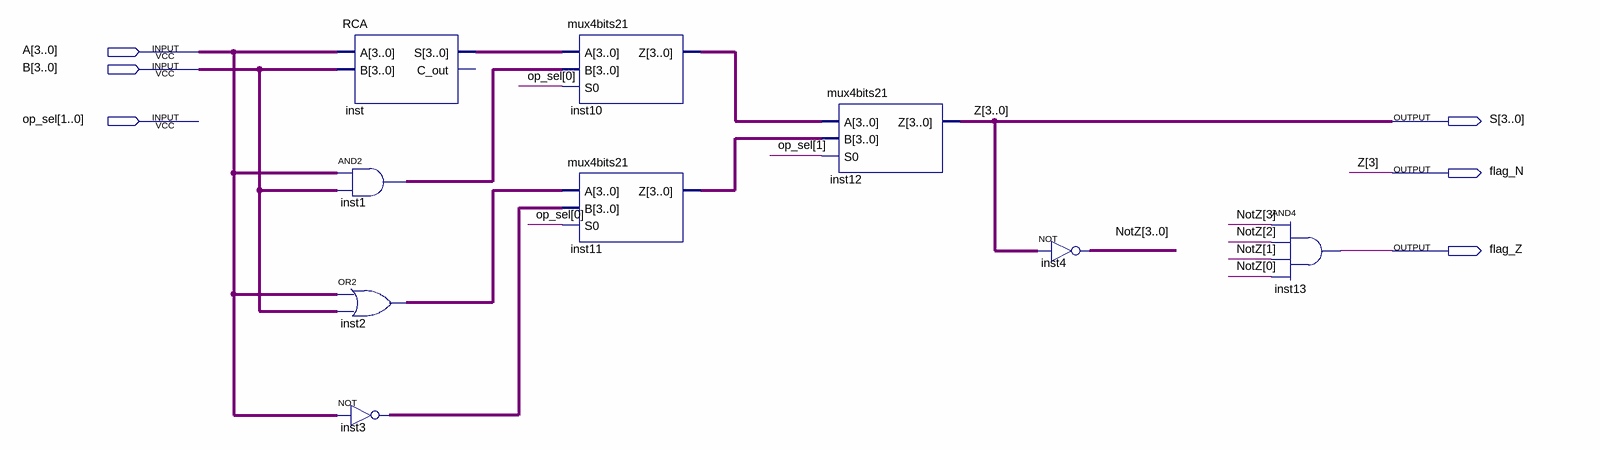
[diagram p0: schematic sheet]
// Quartus schematic ula.bdf as structural Verilog: 9 symbols, 6 pins
module ula (
  input  [3:0] A,
  input  [3:0] B,
  input  [1:0] op_sel,
  output [3:0] S,
  output flag_N,
  output flag_Z
);

  wire [3:0] inst1_out, inst2_out, inst3_out, inst10_z, inst11_z, inst_s, NotZ;

  RCA inst (.A(A), .B(B), .S(inst_s));  // open: C_out
  assign inst1_out = A & B;  // AND2 inst1, 4 bits wide
  assign inst2_out = A | B;  // OR2 inst2, 4 bits wide
  assign inst3_out = ~A;  // NOT inst3, 4 bits wide
  mux4bits21 inst10 (.A(inst_s), .B(inst1_out), .S0(op_sel[0]), .Z(inst10_z));
  mux4bits21 inst11 (.A(inst2_out), .B(inst3_out), .S0(op_sel[0]), .Z(inst11_z));
  mux4bits21 inst12 (.A(inst10_z), .B(inst11_z), .S0(op_sel[1]), .Z({flag_N, S[2:0]}));
  assign NotZ = ~{flag_N, S[2:0]};  // NOT inst4, 4 bits wide
  and inst13 (flag_Z, NotZ[3], NotZ[2], NotZ[1], NotZ[0]);

  assign S[3] = flag_N;

  // Other names for the same wires on the sheet: Z[3:0] = {flag_N, S[2:0]}
endmodule
